# EAGLE design untitled (EAGLE 9.6.2)
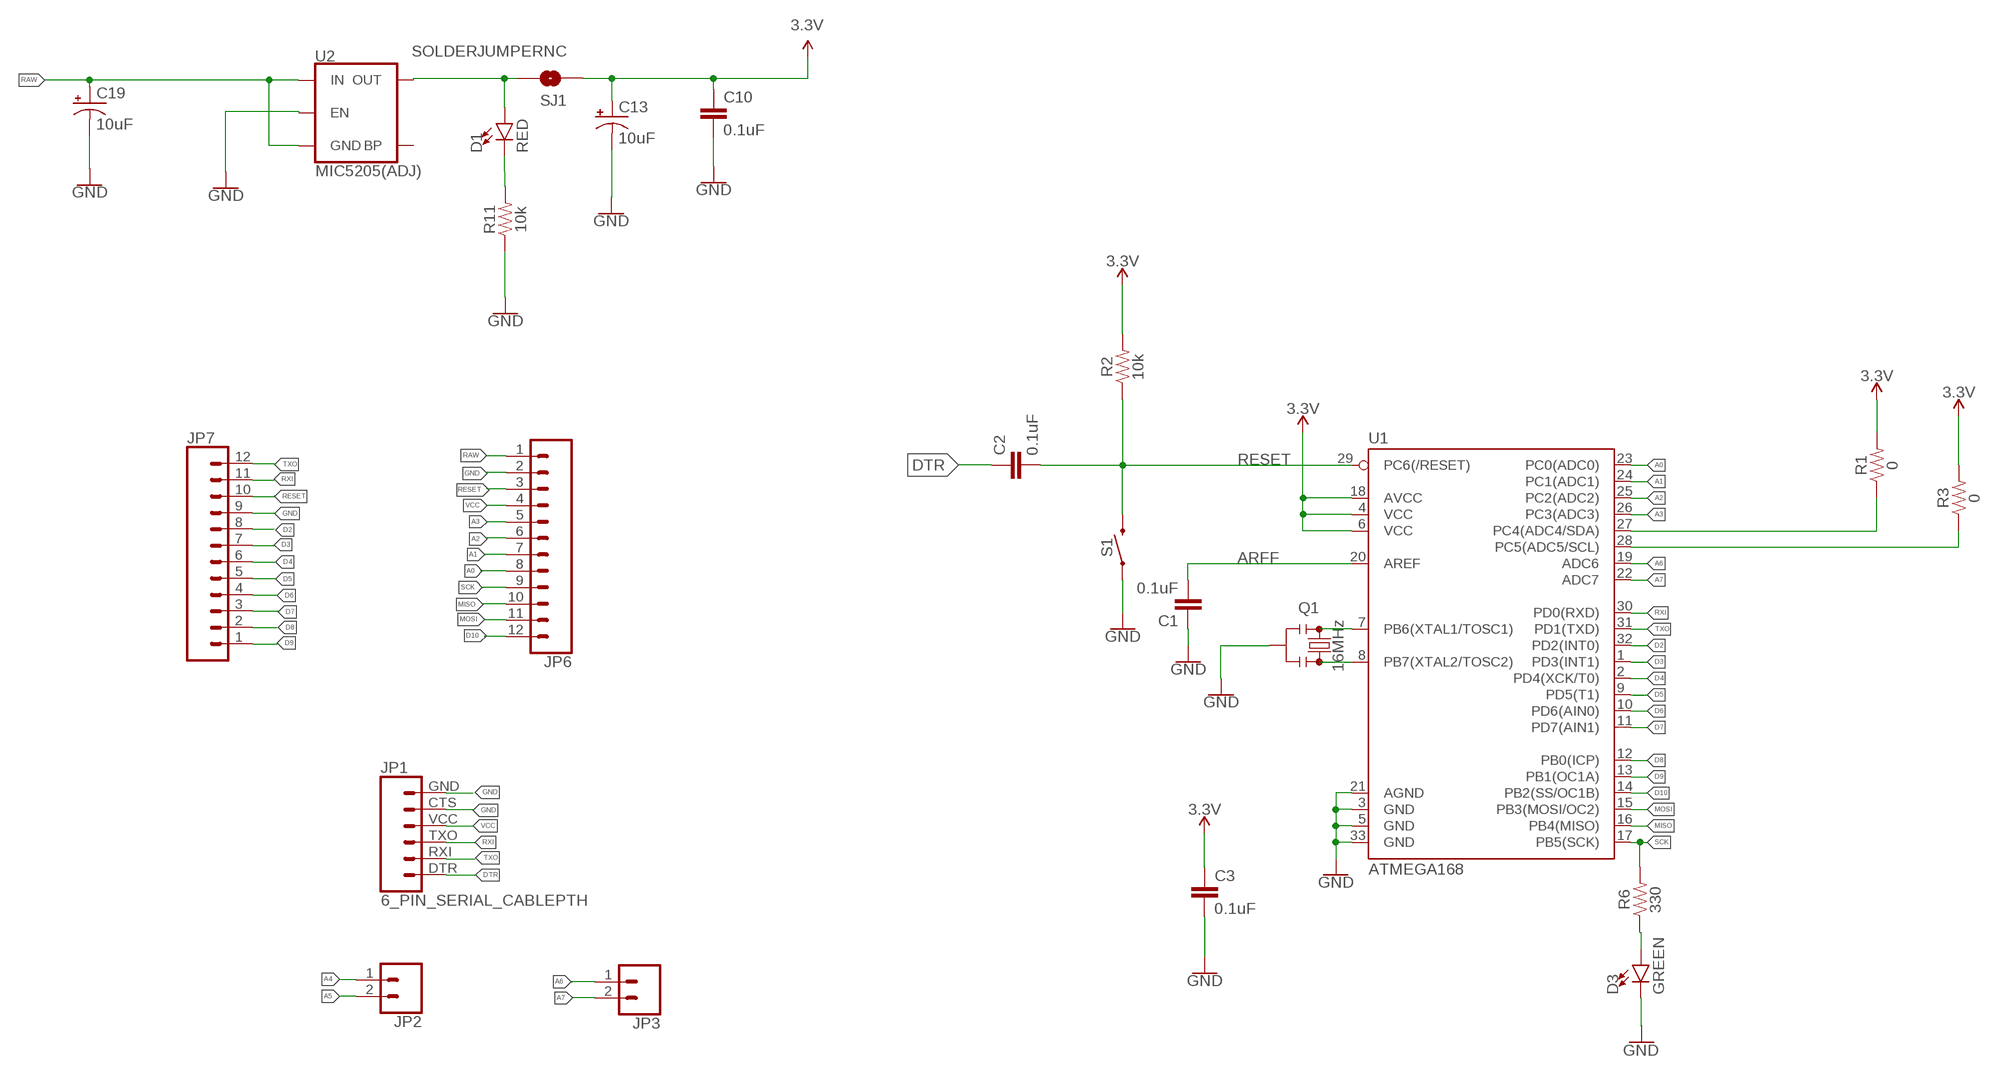
[diagram p0: schematic, sheet 1]

## Parts
C1  0.1uF  0.1UF-0603-25V-(+80/-20%)  [0603]
C2  0.1uF  0.1UF-0603-25V-(+80/-20%)  [0603]
C3  0.1uF  0.1UF-0603-25V-(+80/-20%)  [0603]
C10  0.1uF  0.1UF-0603-25V-(+80/-20%)  [0603]
C13  10uF  10UF-POLAR-0603-6.3V-20%(TANT)  [0603-POLAR]
C19  10uF  10UF-POLAR-0603-6.3V-20%(TANT)  [0603-POLAR]
D1  RED  LED-RED0603  [LED-0603]
D3  GREEN  LED-GREEN0603  [LED-0603]
JP1  6_PIN_SERIAL_CABLEPTH  [FTDI_BASIC]
JP2  CONN_02  [1X02]
JP3  CONN_02  [1X02]
JP6  CONN_12  [1X12]
JP7  CONN_12  [1X12]
Q1  16MHz  RESONATOR-16MHZSMD_3.2X1.3  [RESONATOR-SMD-3.2X1.3]
R1  0  0OHM-0603-1/10W  [0603]
R2  10k  10KOHM-0603-1/10W-1%  [0603]
R3  0  0OHM-0603-1/10W  [0603]
R6  330  330OHM-0603-1/10W-1%  [0603]
R11  10k  10KOHM-0603-1/10W-1%  [0603]
S1  MOMENTARY-SWITCH-SPST-SMD-5.2-TALL-REDUNDANT  [TACTILE_SWITCH_SMD_5.2MM]
SJ1  SOLDERJUMPERNC  [SJ_2S]
U1  ATMEGA168  ATMEGA168_MLFMLF  [MLF32]
U2  MIC5205(ADJ)  V_REG_MIC5205ADJ  [SOT23-5]

## Nets
3.3V: C3.1 C10.1 C13.+ R1.2 R2.2 R3.2 SJ1.1 U1.4(VCC) U1.6(VCC) U1.18(AVCC)
A0: JP6.8 U1.23(PC0(ADC0))
A1: JP6.7 U1.24(PC1(ADC1))
A2: JP6.6 U1.25(PC2(ADC2))
A3: JP6.5 U1.26(PC3(ADC3))
A4: JP2.1
A5: JP2.2
A6: JP3.1 U1.19(ADC6)
A7: JP3.2 U1.22(ADC7)
ARFF: C1.2 U1.20(AREF)
D2: JP7.8 U1.32(PD2(INT0))
D3: JP7.7 U1.1(PD3(INT1))
D4: JP7.6 U1.2(PD4(XCK/T0))
D5: JP7.5 U1.9(PD5(T1))
D6: JP7.4 U1.10(PD6(AIN0))
D7: JP7.3 U1.11(PD7(AIN1))
D8: JP7.2 U1.12(PB0(ICP))
D9: JP7.1 U1.13(PB1(OC1A))
D10: JP6.12 U1.14(PB2(SS/OC1B))
DTR: C2.1 JP1.DTR
GND: C1.1 C3.2 C10.2 C13.- C19.- D3.C JP1.CTS JP1.GND JP6.2 JP7.9 Q1.2 R11.1 S1.1 S1.2 U1.3(GND) U1.5(GND) U1.21(AGND) U1.33(GND) U2.3(EN)
MISO: JP6.10 U1.16(PB4(MISO))
MOSI: JP6.11 U1.15(PB3(MOSI/OC2))
N$1: Q1.3 U1.8(PB7(XTAL2/TOSC2))
N$2: Q1.1 U1.7(PB6(XTAL1/TOSC1))
N$3: R1.1 U1.27(PC4(ADC4/SDA))
N$4: R3.1 U1.28(PC5(ADC5/SCL))
N$5: D3.A R6.1
N$6: D1.A SJ1.2 U2.5(OUT)
N$7: D1.C R11.2
RAW: C19.+ JP6.1 U2.1(IN) U2.2(GND)
RESET: C2.2 JP6.3 JP7.10 R2.1 S1.3 S1.4 U1.29(PC6(/RESET))
RXI: JP1.TXO JP7.11 U1.30(PD0(RXD))
SCK: JP6.9 R6.2 U1.17(PB5(SCK))
TXO: JP1.RXI JP7.12 U1.31(PD1(TXD))
VCC: JP1.VCC JP6.4
Unconnected: U2.4(BP)

## Library data of the parts
C1-C3 C10 = SparkFun-Capacitors:0.1UF: 0.1µF ceramic capacitors A capacitor is a passive two-terminal electrical component used to store electrical energy temporarily in an electric field.; PROD_ID: CAP-00810
C13 C19 = SparkFun-Capacitors:10UF-POLAR: 10.0µF polarized capacitors A capacitor is a passive two-terminal electrical component used to store electrical energy temporarily in an electric field.; PROD_ID: CAP-13210
D1 = SparkFun-LED:LED-RED: Red SMD LED Used in manufacturing of most products at SparkFun Packages: 0603 - SMD 0603 package [Product Link] <http://docs.avagotech.com/docs/AV02-0551EN> 0603 SMART - SMD 0603 SMART package ( more efficient and expensive)[Product Link] <http://www.osram-os.com/Graphics/XPic2/00077099_0.pdf> 1206 - SMD1206 package [Product Link] <https://www.sparkfun.com/datasheets/DevTools/LilyPad/Q150OVS4.pdff> SparkFun Products: Pro Mini 328 -5V <https://www.sparkfun.com/products/821> RedBoard <https://www.sparkfun.com/products/12757> IOIO-OTG <https://www.sparkfun.com/products/13613>; PROD_ID: DIO-00819
D3 = SparkFun-LED:LED-GREEN: Green SMD LED Used in manufacturing of various products at SparkFun Packages: 0603 - SMD 0603 package [Product Link] <http://www.futureelectronics.com/en/technologies/semiconductors/optoelectronics/leds/Pages/9894312-LTST-C190GKT.aspx?CrossPart=HSMG-C190&IM=0> LilyPad 1206 - SMD1206 LilyPad package [Product Link] <http://www.futureelectronics.com/en/Technologies/Product.aspx?ProductID=IN150NGHARVATEKCORPORATION2049943&IM=0> 1206 - SMD1206 package [Product Link] <http://www.futureelectronics.com/en/technologies/semiconductors/optoelectronics/leds/Pages/8315665-LTST-C150KGKT.aspx?IM=0> 1206 Bottom Mount -SMD 1206 Bottom Mount [Product Link] <http://www.digikey.com/product-detail/en/lite-on-inc/LTST-C230KGKT/160-1456-1-ND/386854> SparkFun Products: Pro Mini 328 -5V <https://www.sparkfun.com/products/821> RedBoard <https://www.sparkfun.com/products/12757> MP3 Trigger <https://www.sparkfun.com/products/13720> Makey Makey <https://www.sparkfun.com/products/11076>; PROD_ID: DIO-00821
JP1 = SparkFun-Connectors:6_PIN_SERIAL_CABLE: 6-pin header connection for use with the "FTDI BASIC" pinout - CABLE SIDE. Also known as "Arduino Serial Program Header". This is used on a design to provide a 6-pin connection point for serial communication usually from a USB cable (D+/D-) to these headers (RX/TX). It also has the remaining pins necessary for programming in the Arduino evironment (DTR, GND, and sometimes VCC). Note, this device has "CABLE" in the name. It is intended to be used on a design that usually lives on the end of your USB cable and prvides the converter chip (FTDI232 or FTDI231x) to commnicate serial RX/TX. The "sister" device, named "TARGET" is inteneded to be used on a design that contains a target micro-controller that you wish to program. You can populate with some of these: Female Headers <https://www.sparkfun.com/products/115> (PRT-00115) For reference (or to suit your programming needs) check out these designs: SparkFun FTDI Basic Breakout - 5V <https://www.sparkfun.com/products/9716> (DEV-09716) SparkFun FTDI Basic Breakout - 3.3V <https://www.sparkfun.com/products/9873> (DEV-09873) SparkFun FTDI SmartBasic <https://www.sparkfun.com/products/12935> (DEV-12935) SparkFun Beefy 3 - FTDI Basic Breakout <https://www.sparkfun.com/products/13746> (DEV-13746)
JP2 JP3 = SparkFun-Connectors:CONN_02: Multi connection point. Often used as Generic Header-pin footprint for 0.1 inch spaced/style header connections On any of the 0.1 inch spaced packages, you can populate with these: Break Away Headers - Straight <https://www.sparkfun.com/products/116> (PRT-00116) Break Away Male Headers - Right Angle <https://www.sparkfun.com/products/553> (PRT-00553) Female Headers <https://www.sparkfun.com/products/115> (PRT-00115) Break Away Headers - Machine Pin <https://www.sparkfun.com/products/117> (PRT-00117) Break Away Female Headers - Swiss Machine Pin <https://www.sparkfun.com/products/743> (PRT-00743) For SCREWTERMINALS and SPRING TERMINALS visit here: Screw Terimnals on SparkFun.com <https://www.sparkfun.com/search/results?term=Screw+Terminals> (5mm/3.5mm/2.54mm spacing) This device is also useful as a general connection point to wire up your design to another part of your project. Our various solder wires solder well into these plated through hole pads. Hook-Up Wire - Assortment (Stranded, 22 AWG) <https://www.sparkfun.com/products/11375> (PRT-11375) Hook-Up Wire - Assortment (Solid Core, 22 AWG) <https://www.sparkfun.com/products/11367> (PRT-11367) View the entire wire category on our website here <https://www.sparkfun.com/categories/141> Special notes: Molex polarized connector foot print use with: PRT-08233 with associated crimp pins and housings. 2.54_SCREWTERM for use with PRT-10571. 3.5mm Screw Terminal footprints for PRT-08084 5mm Screw Terminal footprints for use with PRT-08432
JP6 JP7 = SparkFun-Connectors:CONN_12: Multi connection point. Often used as Generic Header-pin footprint for 0.1 inch spaced/style header connections On any of the 0.1 inch spaced packages, you can populate with these: Break Away Headers - Straight <https://www.sparkfun.com/products/116> (PRT-00116) Break Away Male Headers - Right Angle <https://www.sparkfun.com/products/553> (PRT-00553) Female Headers <https://www.sparkfun.com/products/115> (PRT-00115) Break Away Headers - Machine Pin <https://www.sparkfun.com/products/117> (PRT-00117) Break Away Female Headers - Swiss Machine Pin <https://www.sparkfun.com/products/743> (PRT-00743) For SCREWTERMINALS and SPRING TERMINALS visit here: Screw Terimnals on SparkFun.com <https://www.sparkfun.com/search/results?term=Screw+Terminals> (5mm/3.5mm/2.54mm spacing) This device is also useful as a general connection point to wire up your design to another part of your project. Our various solder wires solder well into these plated through hole pads. Hook-Up Wire - Assortment (Stranded, 22 AWG) <https://www.sparkfun.com/products/11375> (PRT-11375) Hook-Up Wire - Assortment (Solid Core, 22 AWG) <https://www.sparkfun.com/products/11367> (PRT-11367) View the entire wire category on our website here <https://www.sparkfun.com/categories/141> Special notes: Molex polarized connector foot print use with SKU : PRT-08231 with associated crimp pins and housings. 1MM SMD Version SKU: PRT-10208 NOTES ON THE VARIANTS LOCK and LOCK_LONGPADS... This footprint was designed to help hold the alignment of a through-hole component (i.e. 6-pin header) while soldering it into place. You may notice that each hole has been shifted either up or down by 0.005 of an inch from it's more standard position (which is a perfectly straight line). This slight alteration caused the pins (the squares in the middle) to touch the edges of the holes. Because they are alternating, it causes a "brace" to hold the component in place. 0.005 has proven to be the perfect amount of "off-center" position when using our standard breakaway headers. Although looks a little odd when you look at the bare footprint, once you have a header in there, the alteration is very hard to notice. Also,if you push a header all the way into place, it is covered up entirely on the bottom side.
Q1 = SparkFun-Clocks:RESONATOR-16MHZ: 16MHz Resonator Digikey Example <http://www.digikey.com/product-detail/en/murata-electronics-north-america/CSTCE16M0V53-R0/490-1198-1-ND/584635> Frequency: 16MHz Frequency Stability: ±0.3% Frequency Tolerance: ±0.5% Capacitance: 15pF SparkFun Products SparkFun OpenLog <https://www.sparkfun.com/products/13712> SparkFun MicroView - OLED Arduino Module <https://www.sparkfun.com/products/12923>; PROD_ID: XTAL-08900
R1 R3 = SparkFun-Resistors:0OHM: 0Ω resistor A resistor is a passive two-terminal electrical component that implements electrical resistance as a circuit element. Resistors act to reduce current flow, and, at the same time, act to lower voltage levels within circuits. - Wikipedia; PROD_ID: RES-08609
R2 R11 = SparkFun-Resistors:10KOHM: 10kΩ resistor A resistor is a passive two-terminal electrical component that implements electrical resistance as a circuit element. Resistors act to reduce current flow, and, at the same time, act to lower voltage levels within circuits. - Wikipedia; PROD_ID: RES-00824
R6 = SparkFun-Resistors:330OHM: 330Ω resistor A resistor is a passive two-terminal electrical component that implements electrical resistance as a circuit element. Resistors act to reduce current flow, and, at the same time, act to lower voltage levels within circuits. - Wikipedia; PROD_ID: RES-00818
S1 = SparkFun-Switches:MOMENTARY-SWITCH-SPST: Momentary Switch (Pushbutton) - SPST Normally-open (NO) SPST momentary switches (buttons, pushbuttons). Variants PTH-12MM - 12mm square, through-hole Momentary Pushbutton Switch - 12mm Square <https://www.sparkfun.com/products/9190> (COM-09190) PTH-6.0MM, PTH-6.0MM-KIT - 6.0mm square, through-hole Mini Pushbutton Switch <https://www.sparkfun.com/products/97> (COM-00097) KIT package intended for soldering kit's - only one side of pads' copper is exposed. PTH-RIGHT-ANGLE-KIT - Right-angle, through-hole Right Angle Tactile Button <https://www.sparkfun.com/products/10791> - Used on SparkFun BigTime Watch Kit <https://www.sparkfun.com/products/11734> SMD-12MM - 12mm square, surface-mount Tactile Button - SMD (12mm) <https://www.sparkfun.com/products/12993> (COM-12993) Used on SparkFun PicoBoard <https://www.sparkfun.com/products/11888> SMD-4.5MM - 4.5mm Square Trackball Switch Used on SparkFun Blackberry Trackballer Breakout <https://www.sparkfun.com/products/13169> SMD-4.6MMX2.8MM - 4.60mm x 2.80mm, surface mount Used on SparkFun Pro Micro - RP2040 <https://www.sparkfun.com/products/17717> SMD-5.2MM, SMD-5.2-REDUNDANT - 5.2mm square, surface-mount Mini Pushbutton Switch - SMD <https://www.sparkfun.com/products/8720> (COM-08720) Used on Arduino Pro Mini <https://www.sparkfun.com/products/11114> REDUNDANT package connects both switch circuits together SMD-6.0X3.5MM - 6.0 x 3.5mm, surface mount Momentary Reset Switch SMD <https://www.sparkfun.com/products/8229> (COM-08229) SMD-6.2MM-TALL - 6.2mm square, surface mount Tactile Button - SMD (6mm) <https://www.sparkfun.com/products/12992> Used on SparkFun Digital Sandbox <https://www.sparkfun.com/products/12651> SMD-RIGHT-ANGLE - Right-angle, surface mount Used on SparkFun Block for Intel® Edison - Arduino <https://www.sparkfun.com/products/13036>; PROD_ID: SWCH-14139
SJ1 = SparkFun-Retired:SOLDERJUMPER: Solder Jumper Standard SMD solder jumper. Used to automate production. Two varients : Normally Open and Normally Closed are the same, but have different paste layers. NC will have a large amount of paste and should jumper during reflow.
U1 = SparkFun-IC-Microcontroller:ATMEGA168_MLF: ATMEGA 168 Atmel 32-pin 8-bit micro, 16k flash. SparkFun Products SparkFun Serial Graphic LCD 128x64 <https://www.sparkfun.com/products/9351> (LCD-09351) SparkFun Graphic LCD Serial Backpack <https://www.sparkfun.com/products/9352> (LCD-09352) SparkFun Serial Graphic LCD 160x128 <https://www.sparkfun.com/products/8884> (LCD-08884); PROD_ID: NA-XXXXX
U2 = SparkFun-IC-Power:V_REG_MIC5205: V_REG MIC5205 Standard 3.3V, 5V, and Adjustable 150mA LDO voltage regulator in SOT-23 layout. Micrel part MIC5205. BP (by-pass) pin is used to lower output noise with 470pF cap, may be left open. On the adjustable version BP is used to set output.; PROD_ID: VREG-12594

## Board
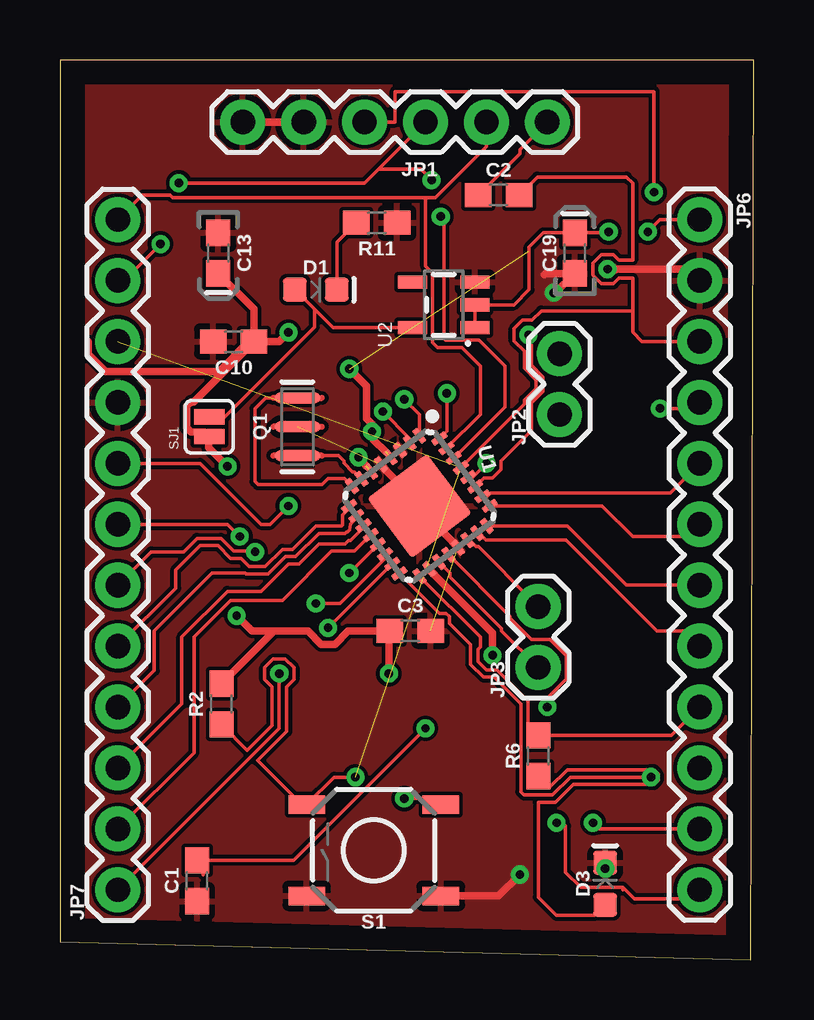
[diagram p1: board, top side]
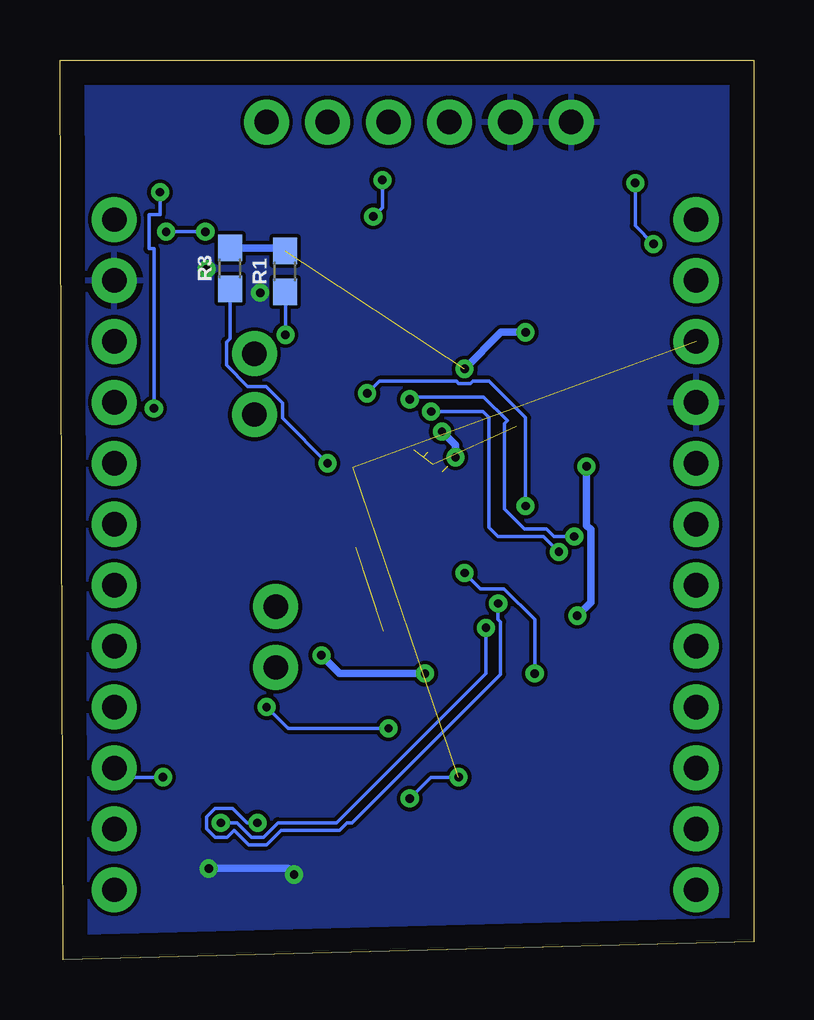
[diagram p2: board, bottom side, seen from below]

Size 28.94 x 37.52 mm. Coordinates in mm from the lower left corner, seen from the top.
Outline: 0,0.76 28.81,0 28.94,37.52 0,37.52 0,0.76
Copper layers (1*16): Top 0.035mm / dielectric 1.5mm / Bottom 0.035mm
Design rules "default": minimum track width 6mil, minimum drill 0.35mm, track to track 6mil, track to pad 6mil, pad to pad 6mil, via to via 6mil, smd to smd 6mil, copper to edge 40mil, drill to drill 6mil, minimum pad ring 10mil, minimum via ring 8mil, stop-mask expansion 4mil, vias tented up to drill 0mil, thermal gap 10mil

### Footprints (pad centres in the part's own frame; a part is rotated, then mirrored left to right if it is on the bottom)
0603 = smd 1.1 x 1: 1 -0.85,0; 2 0.85,0
0603-POLAR = smd 1.1 x 1: + 0.85,0; - -0.85,0
LED-0603 = smd 1 x 1: A -0.877,0; C 0.877,0
FTDI_BASIC = drill 1.016 pad 1.88: CTS 10.16,0; DTR 0,0; GND 12.7,0; RXI 2.54,0; TXO 5.08,0; VCC 7.62,0
1X02 = drill 1.016 pad 1.88: 1 0,0; 2 2.54,0
1X12 = drill 1.016 pad 1.88: 1 0,0; 2 2.54,0; 3 5.08,0; 4 7.62,0; 5 10.16,0; 6 12.7,0; 7 15.24,0; 8 17.78,0; 9 20.32,0; 10 22.86,0; 11 25.4,0; 12 27.94,0
RESONATOR-SMD-3.2X1.3 = smd 0.45 x 1.905: 1 -1.2,0; 2 0,0; 3 1.2,0
TACTILE_SWITCH_SMD_5.2MM = smd 1.524 x 0.762: 1 -2.794,1.905; 2 2.794,1.905; 3 -2.794,-1.905; 4 2.794,-1.905
SJ_2S = smd 0.635 x 1.27: 1 -0.412,0; 2 0.412,0
MLF32 = smd 0.7 x 0.3: 1 -2.35,1.75; 2 -2.35,1.25; 3 -2.35,0.75; 4 -2.35,0.25; 5 -2.35,-0.25; 6 -2.35,-0.75; 7 -2.35,-1.25; 8 -2.35,-1.75; 17 2.35,-1.75; 18 2.35,-1.25; 19 2.35,-0.75; 20 2.35,-0.25; 21 2.35,0.25; 22 2.35,0.75; 23 2.35,1.25; 24 2.35,1.75 | smd 0.3 x 0.7: 9 -1.75,-2.35; 10 -1.25,-2.35; 11 -0.75,-2.35; 12 -0.25,-2.35; 13 0.25,-2.35; 14 0.75,-2.35; 15 1.25,-2.35; 16 1.75,-2.35; 25 1.75,2.35; 26 1.25,2.35; 27 0.75,2.35; 28 0.25,2.35; 29 -0.25,2.35; 30 -0.75,2.35; 31 -1.25,2.35; 32 -1.75,2.35 | smd 3.1 x 3.1: 33 0,0
SOT23-5 = smd 0.55 x 1.2: 1 -0.95,-1.3; 2 0,-1.3; 3 0.95,-1.3; 4 0.95,1.3; 5 -0.95,1.3

### Placement (x,y rotation side)
C1  5.71,3.3 90 top
C2  18.29,31.88 0 top
C3  14.61,13.72 0 top
C10  7.24,25.78 180 top
C13  6.6,29.46 270 top
C19  21.46,29.46 90 top
D1  10.67,27.94 0 top
D3  22.73,3.17 90 top
JP1  20.32,34.92 180 top
JP2  20.83,22.73 90 top
JP3  19.94,12.19 90 top
JP6  26.67,30.86 270 top
JP7  2.41,2.92 90 top
Q1  9.91,22.23 90 top
R1  19.56,28.7 90 bottom
R2  6.73,10.67 90 top
R3  21.84,28.83 90 bottom
R6  19.94,8.51 90 top
R11  13.21,30.73 180 top
S1  13.08,4.57 180 top
SJ1  6.22,22.23 90 top
U1  14.99,18.92 306.8 top
U2  16,27.3 90 top

### Tracks (layer width: path | path; a pad name or v marks a point on that pad's centre or on a via)
3.3V  (via drill 0.35)  (3 unrouted)
  Top 0.305: R2.2 8.93,13.72 | SJ1.1 6.21,21.83 | 6.21,21.83 6.02,22.02 5.46,22.02 5.28,22.19 5.28,23.08 5.46,23.26 5.57,23.26 6.65,24.34 | 6.65,24.34 C10.1 | C13.+ 8.09,27.13 C10.1 | v18.03,12.7 18.03,13.63 15.62,16.04 15.62,16.07 U1.18 15.34,16.29 | v13.72,11.94 13.72,13.68 C3.1 12.02,13.72 11.46,13.16 10.89,13.16 10.34,13.72 8.93,13.72 | 13.59,21.17 13.08,21.68 13.08,22.1 v13.01,22.03 13.01,22.35 12.78,22.58 12.78,23.92 v12.06,24.64 | v12.45,20.96 12.45,20.91 12.75,20.6 12.75,20.58 | 1.17,25.78 1.17,25.27 1.9,24.54 6.45,24.54 6.65,24.34 | C10.1 7.87,25.78 6.62,24.54 | C10.1 9.14,25.78 v9.53,26.16 | 8.93,13.72 8,13.72 v7.37,14.35 | v6.99,20.57 6.21,21.35 6.21,21.83
  Bottom 0.305: v18.03,12.7 17.27,11.94 v13.72,11.94 | v13.01,22.03 12.45,21.46 v12.45,20.96 | R3.2 19.68,29.68 R1.2 | v9.53,26.16 10.54,26.16 v12.06,24.64 | v6.99,20.57 6.99,18.11 6.81,17.94 6.81,14.91 v7.37,14.35
A0
  Top 0.152: U1.23 17.48,17.79 17.77,17.51 21.1,17.51 24.89,13.72 26.04,13.72 JP6.8
A1
  Top 0.152: U1.24 21.15,18.09 23.62,15.62 JP6.7
A2
  Top 0.152: U1.25 22.6,18.93 23.88,17.65 26.16,17.65 JP6.6
A3
  Top 0.152: U1.26 17.82,19.33 17.96,19.47 25.44,19.47 JP6.5
A4
  Top 0.305: JP2.1 21.08,22.48 21.34,22.48
A5
  Top 0.305: JP2.2 21.08,25.02 21.08,24.77
A6
  Top 0.152: U1.19 16.26,16.13 16.26,15.97 18.41,13.81 18.41,13.72 JP3.1
  Top 0.305: JP3.1 19.94,12.32 20.32,12.7
A7
  Top 0.152: 19.68,14.99 17.45,17.23 17.35,17.23 17.08,17.49 U1.22
  Top 0.305: JP3.2 19.68,14.99
ARFF  (via drill 0.35)
  Top 0.152: 5.97,3.56 5.97,3.9 C1.2 9.74,4.15 v15.24,9.65 | U1.20 18.77,14.31 18.77,14.25 19.66,13.36 20.42,13.36 21.11,12.68 21.11,11.71 20.32,10.92 v20.32,10.54
  Bottom 0.152: v20.32,10.54 19.43,9.65 v15.24,9.65
D2  (via drill 0.35)
  Top 0.152: JP7.8 5.84,20.7 8.38,18.16 8.76,18.16 v9.53,18.92 | v16.13,23.62 16.13,22.04 U1.32
  Bottom 0.152: v9.53,18.92 9.53,22.61 11.05,24.13 11.71,24.13 11.81,24.03 12.32,24.03 12.41,24.13 15.62,24.13 v16.13,23.62
D3  (via drill 0.35)
  Top 0.152: JP7.7 6.99,18.16 v7.49,17.65 | v14.35,23.37 14.98,22.74 U1.1
  Bottom 0.152: v7.49,17.65 8.35,17.65 8.65,17.96 9.58,17.96 10.41,18.8 10.41,22.35 10.29,22.48 11.28,23.47 14.25,23.47 v14.35,23.37
D4  (via drill 0.35)
  Top 0.152: JP7.6 3.8,17.01 5.15,17.01 5.72,17.58 6.71,17.58 7.24,17.05 7.8,17.05 7.83,17.01 v8.14,17.01 | v13.46,22.86 14.58,21.74 U1.2
  Bottom 0.152: v8.14,17.01 8.78,17.65 10.67,17.65 11.05,18.03 11.05,22.61 11.3,22.86 v13.46,22.86
D5
  Top 0.152: JP7.5 4.83,15.49 4.83,16.26 5.84,17.27 6.58,17.27 7.12,16.74 7.55,16.74 7.88,16.4 8.56,16.4 9.27,17.12 9.7,17.12 10.67,18.09 11.73,18.09 11.77,18.12 11.77,18.54 12.06,18.83 U1.9
D6
  Top 0.152: 1.78,10.16 2.03,10.16 JP7.4 3.94,12.07 3.94,13.72 6.35,16.13 7.73,16.13 7.76,16.1 8.68,16.1 9.4,16.82 9.83,16.82 10.79,17.78 11.89,17.78 11.94,17.83 11.99,17.83 12.07,17.91 12.07,17.93 12.11,18.18 12.36,18.43 U1.10
D7
  Top 0.152: JP7.3 5.08,10.67 5.08,13.46 6.99,15.37 8.38,15.37 9.53,16.51 9.96,16.51 10.8,17.34 11.88,17.34 12.03,17.49 12.12,17.49 12.65,18.03 U1.11
D8
  Top 0.152: 2.41,6.1 JP7.2 5.59,8.64 5.59,13.46 7.11,14.99 9.27,14.99 11.33,17.04 12.28,17.04 U1.12
D9  (via drill 0.35)
  Top 0.152: JP7.1 9.14,9.65 v9.14,11.94 | v12.06,16.13 U1.13
  Bottom 0.152: v12.06,16.13 11.4,15.47 10.42,15.47 9.14,14.19 v9.14,11.94
D10  (via drill 0.35)
  Top 0.152: 23.46,2.92 23.46,3.03 | JP6.12 26.29,2.54 23.95,2.54 23.46,3.03 | v20.7,5.71 20.95,5.71 21.08,5.59 21.08,3.66 21.72,3.03 23.46,3.03 | U1.14 13.55,16.73 11.68,14.86 v10.67,14.86
  Bottom 0.152: v20.7,5.71 21.13,5.71 21.73,6.32 22.48,6.32 22.83,5.97 22.83,5.46 22.48,5.11 21.97,5.11 21.68,5.4 21.08,4.8 20.32,4.8 19.72,5.41 17.27,5.41 16.97,5.71 16.76,5.71 10.57,11.91 10.57,14.09 10.67,14.19 v10.67,14.86
DTR
  Top 0.152: C2.1 19.18,33.62 19.18,33.78 JP1.DTR
GND  (via drill 0.35)  (3 unrouted)
  Top 0.305: U1.5 13.6,20.43 13.6,20.41 14.99,19.02 U1.33 14.99,18.82 16.37,17.44 16.37,17.41 U1.21 | JP1.GND JP1.CTS | JP6.2 26.2,28.8 v22.83,28.8 | S1.1 18.29,2.67 v19.18,3.56 | v22.73,3.81 D3.C | 20.19,28.57 20.23,28.61 C19.- 20.66,27.81 v20.59,27.81
  Bottom 0.305: v19.18,3.56 19.43,3.81 v22.73,3.81
  pour Top: -1.27,39.12 -1.27,-2.03 30.73,-2.03 30.73,39.12
  pour Bottom: -2.29,40.13 -2.29,-3.3 32,-3.3 32,40.13
MISO  (via drill 0.35)
  Top 0.152: U1.16 15.82,14.45 16.1,14.45 16.23,14.31 16.23,14.03 17.12,13.14 17.12,12.32 17.66,11.79 18.09,11.79 19.21,10.67 19.21,7.01 19.34,6.88 20.53,6.88 21.27,7.62 v24.64,7.62
  Bottom 0.152: v24.64,7.62 26.29,7.62 JP6.10
  other vias: 26.67,8
MOSI  (via drill 0.35)
  Top 0.152: 26.16,5.21 26.67,5.21 JP6.11 22.48,5.46 v22.23,5.71 | v11.18,13.84 U1.15
  Bottom 0.152: v22.23,5.71 21.56,5.71 20.95,5.11 20.45,5.11 19.84,5.71 17.4,5.71 11.18,11.94 v11.18,13.84
N$1
  Top 0.152: Q1.3 8.57,23.43 8.13,22.99 8.13,19.94 8.26,19.81 10.92,19.81 11.18,20.07 11.87,20.07 U1.8
N$2
  Top 0.152: Q1.1 11.61,21.03 11.84,20.79 11.84,20.7 12.2,20.35 12.29,20.35 U1.7
N$3  (via drill 0.35)
  Top 0.152: U1.27 17.68,20.09 18.03,20.09 18.39,20.45 18.39,20.8 19.66,22.07 19.66,23.22 20.14,23.7 20.14,24.3 19.66,24.79 19.66,25.63 19.53,25.76 v19.53,26.06
  Bottom 0.152: v19.53,26.06 19.53,27.83 R1.1
N$4  (via drill 0.35)
  Top 0.152: v17.78,20.7 17.21,20.13 U1.28
  Bottom 0.152: R3.1 21.84,25.91 22,25.76 22,24.79 21.11,23.9 20.34,23.9 19.66,23.22 19.66,22.58 v17.78,20.7
N$5
  Top 0.152: 22.66,2.23 22.29,1.85 20.7,1.85 19.94,2.62 19.94,6.58 20.66,6.58 21.4,7.31 24.76,7.31 24.94,7.49 24.94,7.75 24.76,7.93 21.15,7.93 20.41,7.19 19.94,7.19 R6.1
  Top 0.305: D3.A 22.66,2.23
N$6
  Top 0.152: D1.A 10.61,27.12 | 10.61,27.12 11.38,26.36 U2.5 | SJ1.2 6.86,22.64 10.61,26.39 10.61,27.12
N$7
  Top 0.152: D1.C 11.54,29.92 R11.2
RAW  (via drill 0.35)
  Top 0.152: U2.1 U2.2 18.92,27.3 19.56,27.94 19.56,29.72 20.15,30.31 C19.+ 22.84,30.31 v22.88,30.35 | v24.51,30.35 25.02,30.86 JP6.1
  Bottom 0.152: v22.88,30.35 v24.51,30.35
RESET  (via drill 0.35)  (2 unrouted)
  Top 0.152: C2.2 19.9,32.64 23.62,32.64 23.88,32.38 23.88,29.18 23.3,29.18 23.08,29.4 22.58,29.4 22.22,29.05 22.22,28.55 22.58,28.19 23.08,28.19 23.3,28.41 23.88,28.41 23.88,27.05 | 26.29,26.16 JP6.3 24.26,25.78 23.88,26.16 23.88,27.05 | R2.1 7.8,8.74 8.84,9.78 8.84,11.38 8.54,11.69 8.54,12.19 8.89,12.54 9.39,12.54 9.75,12.19 9.75,11.69 9.45,11.38 9.45,9.53 8.24,8.31 10.07,6.48 S1.4 11.43,7.62 v12.32,7.62 | U1.29 19.36,23.17 19.36,23.34 19.84,23.83 19.84,24.18 19.36,24.66 19.36,25.38 18.93,25.81 18.93,26.31 19.28,26.67 19.68,26.67 20.07,27.05 23.88,27.05 | v14.35,6.73 15.62,6.73 S1.3
  Bottom 0.152: v12.32,7.62 13.46,7.62 v14.35,6.73
RXI  (via drill 0.35)
  Top 0.152: JP1.TXO 13.27,32.96 | 13.27,32.96 12.7,32.38 v4.95,32.38 | v4.19,29.84 2.67,28.32 JP7.11 | U1.30 18.54,23.05 18.54,24.77 17.48,25.83 16.08,25.83 16,25.91 16,30.86 v15.88,30.99 | v15.49,32.51 15.05,32.96 13.27,32.96
  Bottom 0.152: v4.95,32.38 4.95,30.61 v4.19,29.84 | v15.88,30.99 15.49,31.37 v15.49,32.51
SCK
  Top 0.152: U1.17 17.53,13.46 17.53,13.05 17.43,12.95 17.43,12.45 17.78,12.09 18.21,12.09 19.52,10.79 19.52,9.36 R6.2 25.49,9.36 JP6.9
TXO
  Top 0.152: JP1.RXI 17.78,33.91 15.65,31.78 15.24,31.78 | JP7.12 3.43,31.88 4.6,31.88 4.7,31.78 15.24,31.78 | U1.31 17.53,22.74 17.53,24.77 16.76,25.53 15.75,25.53 15.53,25.75 15.53,28.62 15.24,28.91 15.24,31.78
VCC  (via drill 0.35)
  Top 0.152: JP1.VCC 13.97,34.92 13.97,36.2 24.77,36.2 v24.77,32 | v25.02,22.99 26.67,22.99 JP6.4
  Bottom 0.152: v24.77,32 24.77,31.06 25.22,31.06 25.22,29.64 25.02,29.64 v25.02,22.99